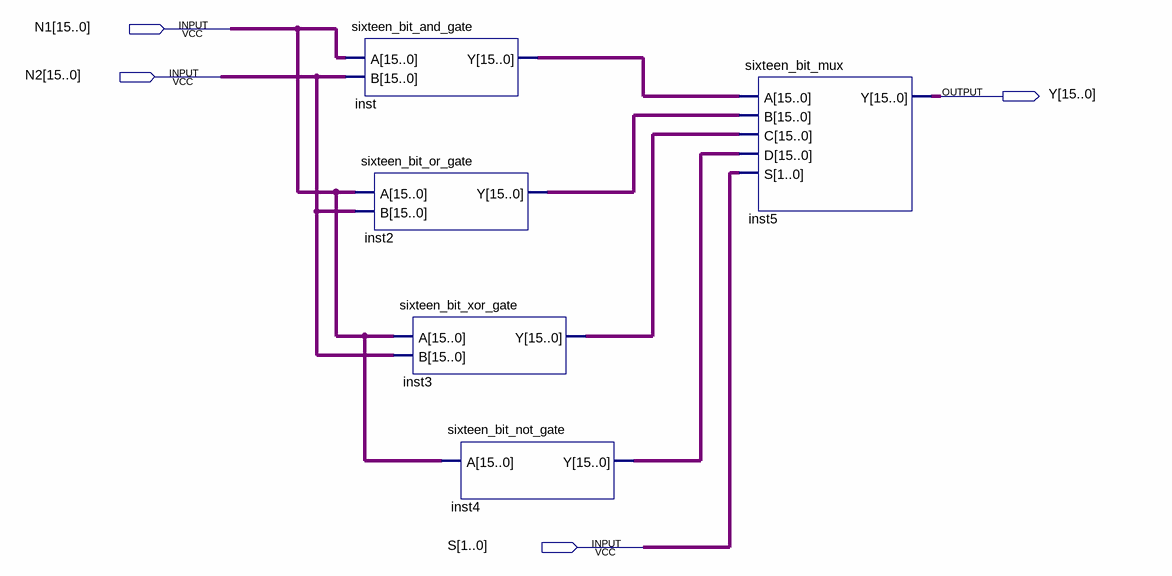
[diagram p0: schematic sheet]
// Quartus schematic LOGIC_ALU.bdf as structural Verilog: 5 symbols, 4 pins
module LOGIC_ALU (
  input  [15:0] N1,
  input  [15:0] N2,
  input  [1:0] S,
  output [15:0] Y
);

  wire [15:0] inst2_y, inst3_y, inst4_y, inst_y;

  sixteen_bit_and_gate inst (.A(N1), .B(N2), .Y(inst_y));
  sixteen_bit_or_gate inst2 (.A(N1), .B(N2), .Y(inst2_y));
  sixteen_bit_xor_gate inst3 (.A(N1), .B(N2), .Y(inst3_y));
  sixteen_bit_not_gate inst4 (.A(N1), .Y(inst4_y));
  sixteen_bit_mux inst5 (.A(inst_y), .B(inst2_y), .C(inst3_y), .D(inst4_y), .S(S), .Y(Y));
endmodule
